# EAGLE design A111_Pulsed_Radar_Breakout (EAGLE 9.5.2)
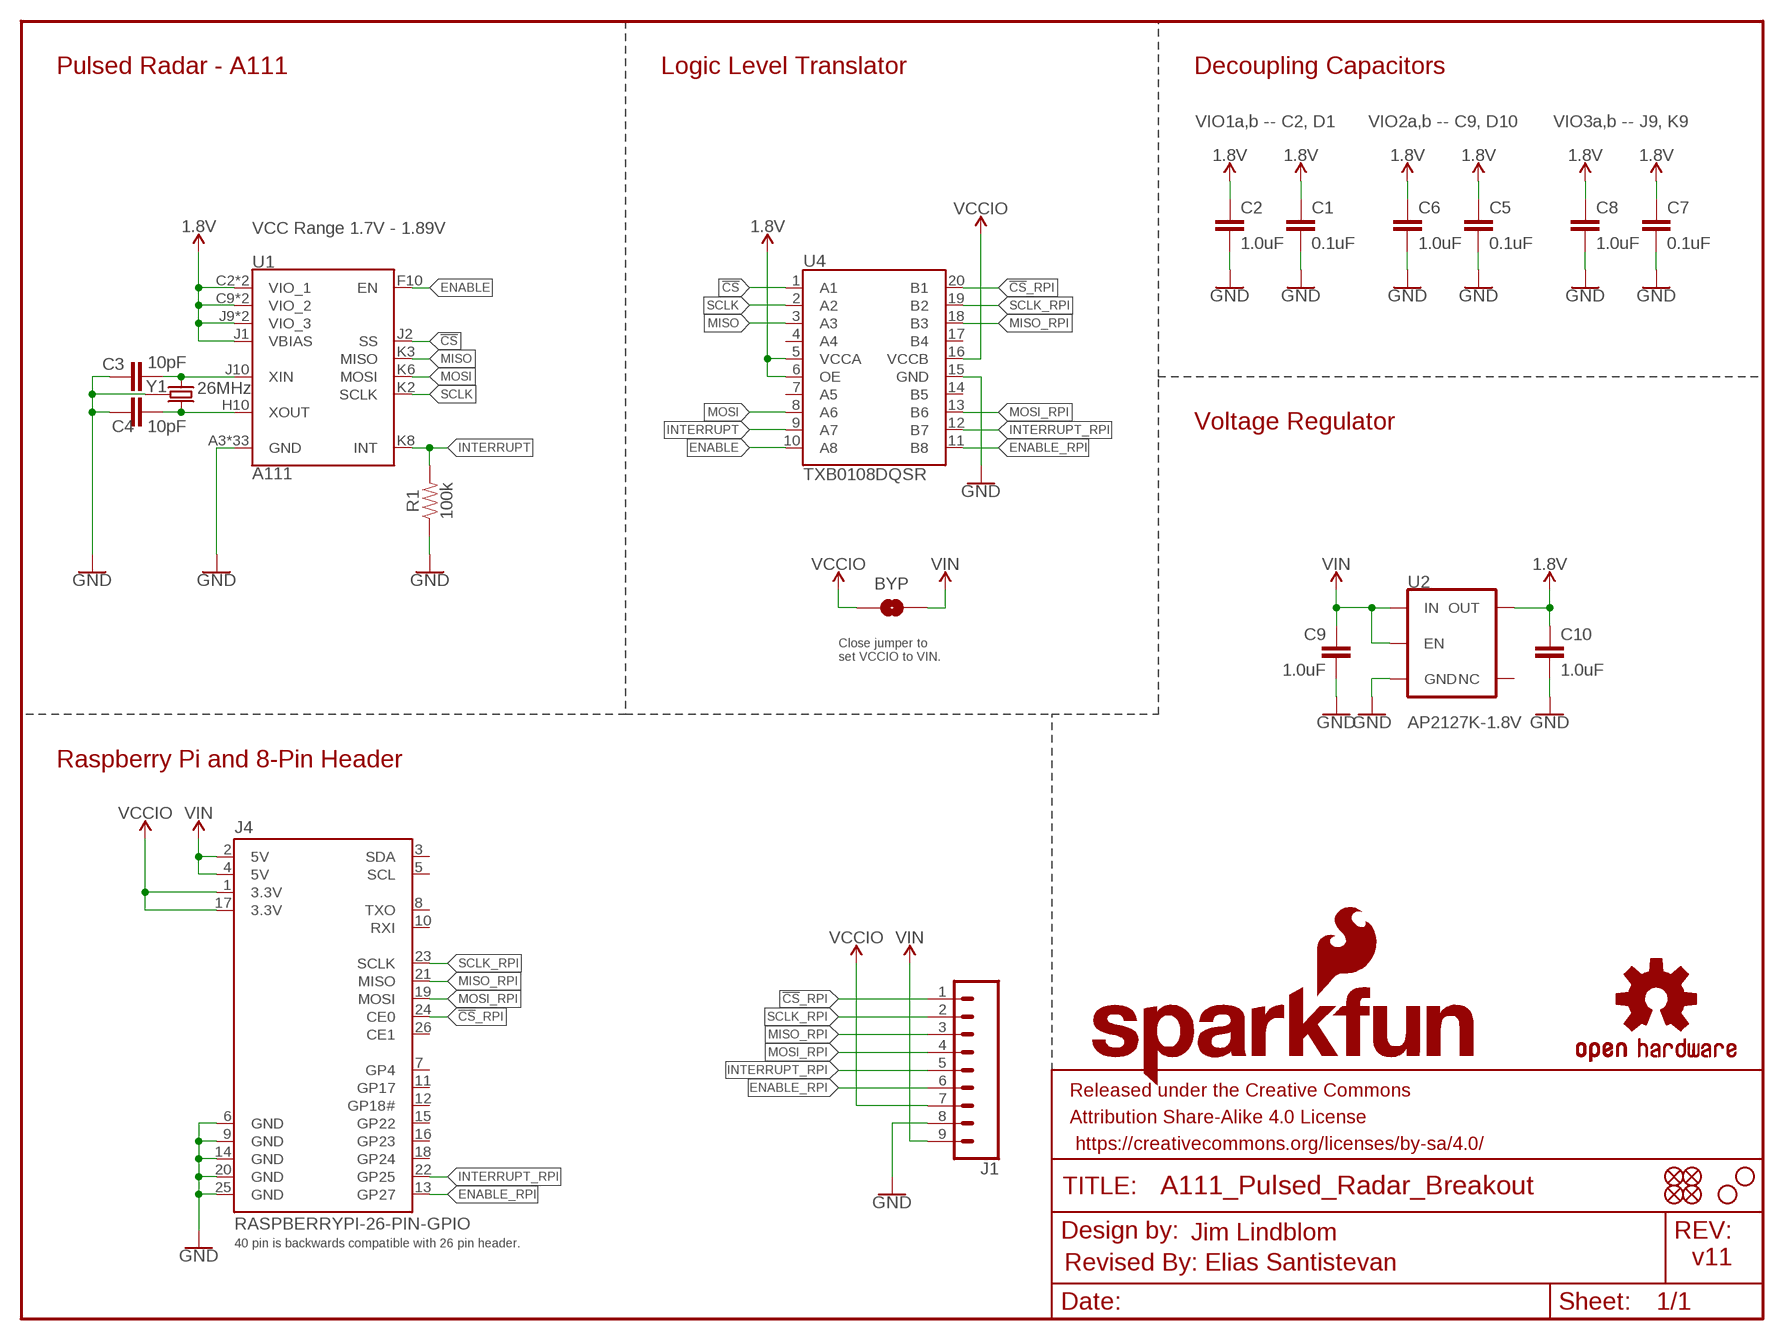
[diagram p0: schematic, sheet 1]

## Parts
BYP  JUMPER-SMT_2_NO_SILK  [SMT-JUMPER_2_NO_SILK]
C1  0.1uF  0.1UF-0603-25V-(+80/-20%)  [0603]
C2  1.0uF  1.0UF-0603-16V-10%  [0603]
C3  10pF  10PF-0603-50V-5%  [0603]
C4  10pF  10PF-0603-50V-5%  [0603]
C5  0.1uF  0.1UF-0603-25V-(+80/-20%)  [0603]
C6  1.0uF  1.0UF-0603-16V-10%  [0603]
C7  0.1uF  0.1UF-0603-25V-(+80/-20%)  [0603]
C8  1.0uF  1.0UF-0603-16V-10%  [0603]
C9  1.0uF  1.0UF-0603-16V-10%  [0603]
C10  1.0uF  1.0UF-0603-16V-10%  [0603]
FD1  FIDUCIALUFIDUCIAL  [FIDUCIAL-MICRO]
FD2  FIDUCIALUFIDUCIAL  [FIDUCIAL-MICRO]
FD3  FIDUCIALUFIDUCIAL  [FIDUCIAL-MICRO]
FD4  FIDUCIALUFIDUCIAL  [FIDUCIAL-MICRO]
FRAME1  FRAME-LETTER  [CREATIVE_COMMONS]
H1  STAND-OFF  [STAND-OFF]
H2  STAND-OFF  [STAND-OFF]
J1  CONN_09NO_SILK  [1X09_NO_SILK]
J4  RASPBERRYPI-26-PIN-GPIO  [2X13]
LOGO1  SFE_LOGO_NAME_FLAME.1_INCH  [SFE_LOGO_NAME_FLAME_.1]
LOGO2  OSHW-LOGOS  [OSHW-LOGO-S]
R1  100k  100KOHM-0603-1/10W-1%  [0603]
U1  A111  [A111]
U2  AP2127K-1.8V  V_REG_AP2127K-1.8V  [SOT23-5]
U4  TXB0108DQSR  TXB0108  [UFDFN-20]
Y1  26MHz  CRYSTAL-26MHZSMD-3.2X2.5  [CRYSTAL-SMD-3.2X2.5MM]

## Nets
1.8V: C1.1 C2.1 C5.1 C6.1 C7.1 C8.1 C10.1 U1.C2(VIO_1) U1.C9(VIO_2) U1.D1(VIO_1) U1.D10(VIO_2) U1.J1(VBIAS) U1.J9(VIO_3) U1.K9(VIO_3) U2.5(OUT) U4.5(VCCA) U4.6(OE)
!CS!: U1.J2(SS) U4.1(A1)
!CS!_RPI: J1.1 J4.24(CE0) U4.20(B1)
ENABLE: U1.F10(EN) U4.10(A8)
ENABLE_RPI: J1.6 J4.13(GP27) U4.11(B8)
GND: C1.2 C2.2 C3.2 C4.1 C5.2 C6.2 C7.2 C8.2 C9.2 C10.2 J1.8 J4.6(GND) J4.9(GND) J4.14(GND) J4.20(GND) J4.25(GND) R1.1 U1.A3(GND) U1.A4(GND) U1.A5(GND) U1.A6(GND) U1.A7(GND) U1.A8(GND) U1.A9(GND) U1.B2(GND) U1.B9(GND) U1.B10(GND) U1.C1(GND) U1.C10(GND) U1.D2(GND) U1.D9(GND) U1.E1(GND) U1.E2(GND) U1.E9(GND) U1.E10(GND) U1.F1(GND) U1.F2(GND) U1.F9(GND) U1.G1(GND) U1.G10(GND) U1.H1(GND) U1.H2(GND) U1.H9(GND) U1.J3(GND) U1.J5(GND) U1.J6(GND) U1.J8(GND) U1.K4(GND) U1.K5(GND) U1.K7(GND) U2.2(GND) U4.15(GND) Y1.2(GND) Y1.4(GND)
INTERRUPT: R1.2 U1.K8(INT) U4.9(A7)
INTERRUPT_RPI: J1.5 J4.22(GP25) U4.12(B7)
MISO: U1.K3(MISO) U4.3(A3)
MISO_RPI: J1.3 J4.21(MISO) U4.18(B3)
MOSI: U1.K6(MOSI) U4.8(A6)
MOSI_RPI: J1.4 J4.19(MOSI) U4.13(B6)
N$1: C3.1 U1.J10(XIN) Y1.1
N$2: C4.2 U1.H10(XOUT) Y1.3
SCLK: U1.K2(SCLK) U4.2(A2)
SCLK_RPI: J1.2 J4.23(SCLK) U4.19(B2)
VCCIO: BYP.1 J1.7 J4.1(3.3V) J4.17(3.3V) U4.16(VCCB)
VIN: BYP.2 C9.1 J1.9 J4.2(5V) J4.4(5V) U2.1(IN) U2.3(EN)
Unconnected: J4.3(SDA) J4.5(SCL) J4.7(GP4) J4.8(TXO) J4.10(RXI) J4.11(GP17) J4.12(GP18#) J4.15(GP22) J4.16(GP23) J4.18(GP24) J4.26(CE1) U2.4(NC) U4.4(A4) U4.7(A5) U4.14(B5) U4.17(B4)

## Notes on the sheet
- Pulsed Radar - A111 | Logic Level Translator | Decoupling Capacitors
- VIO1a,b -- C2, D1 | VIO2a,b -- C9, D10 | VIO3a,b -- J9, K9
- VCC Range 1.7V - 1.89V
- Voltage Regulator
- Close jumper to 
  set VCCIO to VIN.
- Raspberry Pi and 8-Pin Header
- Jim Lindblom
- 40 pin is backwards compatible with 26 pin header.
- Revised By: Elias Santistevan | v11

## Library data of the parts
BYP = SparkFun-Jumpers:JUMPER-SMT_2_NO: Normally open jumper This jumper has two pads in close proximity to each other. Apply solder to close the connection. Round pads are easier to solder for beginners, but are a lot larger. SparkFun Product that uses the round pads: SparkFun EL Sequencer <https://www.sparkfun.com/products/12781>
C1 C5 C7 = SparkFun-Capacitors:0.1UF: 0.1µF ceramic capacitors A capacitor is a passive two-terminal electrical component used to store electrical energy temporarily in an electric field.; PROD_ID: CAP-00810
C2 C6 C8-C10 = SparkFun-Capacitors:1.0UF: 1µF ceramic capacitors A capacitor is a passive two-terminal electrical component used to store electrical energy temporarily in an electric field.; PROD_ID: CAP-00868
C3 C4 = SparkFun-Capacitors:10PF: 10pF ceramic capacitors A capacitor is a passive two-terminal electrical component used to store electrical energy temporarily in an electric field.; PROD_ID: CAP-11812
FD1-FD4 = SparkFun-Aesthetics:FIDUCIAL: Fiducial Alignment Points Point-of-reference for pick-and-place machines and other optical instruments.
FRAME1 = SparkFun-Aesthetics:FRAME-LETTER: Schematic Frame - Letter Standard 8.5x11 US Letter frame
H1 H2 = SparkFun-Hardware:STAND-OFF: Stand Off Drill holes for mechanically mounting via screws, standoffs, etc. Note: Use the keepout ring to avoid running the screw head into surrounding components. Variant Overviews STAND-OFF - Mechanical footprint for a #4 phillips button head screw. STAND-OFF-TIGHT - Mechanical footprint for a #4 phillips button head screw, Example SparkFun Products Screw - Phillips Head (1/4", 4-40, 10 pack) <https://www.sparkfun.com/products/10453> (PRT-10453) Screw - Phillips Head (1/2", 4-40, 10 pack) <https://www.sparkfun.com/products/10452> (PRT-10452) Screw - Phillips Head (3/4", 4-40, 10 pack) <https://www.sparkfun.com/products/10451> (PRT-10451) Screw - Phillips Head (1", 4-40, 10 pack) <https://www.sparkfun.com/products/10450> (PRT-10450)
J1 = SparkFun-Connectors:CONN_09: Multi connection point. Often used as Generic Header-pin footprint for 0.1 inch spaced/style header connections On any of the 0.1 inch spaced packages, you can populate with these: Break Away Headers - Straight <https://www.sparkfun.com/products/116> (PRT-00116) Break Away Male Headers - Right Angle <https://www.sparkfun.com/products/553> (PRT-00553) Female Headers <https://www.sparkfun.com/products/115> (PRT-00115) Break Away Headers - Machine Pin <https://www.sparkfun.com/products/117> (PRT-00117) Break Away Female Headers - Swiss Machine Pin <https://www.sparkfun.com/products/743> (PRT-00743) For SCREWTERMINALS and SPRING TERMINALS visit here: Screw Terimnals on SparkFun.com <https://www.sparkfun.com/search/results?term=Screw+Terminals> (5mm/3.5mm/2.54mm spacing) This device is also useful as a general connection point to wire up your design to another part of your project. Our various solder wires solder well into these plated through hole pads. Hook-Up Wire - Assortment (Stranded, 22 AWG) <https://www.sparkfun.com/products/11375> (PRT-11375) Hook-Up Wire - Assortment (Solid Core, 22 AWG) <https://www.sparkfun.com/products/11367> (PRT-11367) View the entire wire category on our website here <https://www.sparkfun.com/categories/141> Special notes: Molex polarized connector foot print use with SKU : PRT-08231 with associated crimp pins and housings. 1MM SMD Version SKU: PRT-10208 NOTES ON THE VARIANTS LOCK and LOCK_LONGPADS... This footprint was designed to help hold the alignment of a through-hole component (i.e. 6-pin header) while soldering it into place. You may notice that each hole has been shifted either up or down by 0.005 of an inch from it's more standard position (which is a perfectly straight line). This slight alteration caused the pins (the squares in the middle) to touch the edges of the holes. Because they are alternating, it causes a "brace" to hold the component in place. 0.005 has proven to be the perfect amount of "off-center" position when using our standard breakaway headers. Although looks a little odd when you look at the bare footprint, once you have a header in there, the alteration is very hard to notice. Also,if you push a header all the way into place, it is covered up entirely on the bottom side.
J4 = SparkFun-Connectors:RASPBERRYPI-26-PIN-GPIO: RASPBERRY PI I/O HEADER As defined for the Revistion 2 Pi. The 40 pin header is backwards compatible with this smaller more compact footprint.
LOGO1 = SparkFun-Aesthetics:SFE_LOGO_NAME_FLAME: SparkFun Font Logo w/ Flame This is the SparkFun full logo. The logo on the schematic will always be the same size; the package variant is the height of the flame part of the logo. Default layer for the logo on the board is tSilk.
LOGO2 = SparkFun-Aesthetics:OSHW-LOGO: Open-Source Hardware (OSHW) Logo This logo indicates the piece of hardware it is found on incorporates a OSHW license and/or adheres to the definition of open source hardware found here: http://freedomdefined.org/OSHW
R1 = SparkFun-Resistors:100KOHM: 100kΩ resistor A resistor is a passive two-terminal electrical component that implements electrical resistance as a circuit element. Resistors act to reduce current flow, and, at the same time, act to lower voltage levels within circuits. - Wikipedia; PROD_ID: RES-07828
U1 = SparkFun-Sensors:A111; PROD_ID: IC-14498
U2 = SparkFun-IC-Power:V_REG_AP2127: AP2127 - 300mA CMOS LDO Regulator w/ Enable The AP2127 is CMOS process low dropout linear regulator with enable function, the regulator delivers a guaranteed 300mA (min.) continuous load current. Features Output Voltage Accuracy: ±1.5% Output Current: 300mA (Min.) Foldback Short Current Protection: 50mA Enable Function to Turn ON/OFF VOUT Low Dropout Voltage (3.3V): 250mV (Typ.) @IOUT=600mA Excellent Load Regulation: 0.2%/A (Typ.) Excellent Line Regulation: 0.02%/V (Typ.) Low Quiescent Current: 55μA (Typ.) Low Standby Current: 0.01μA (Typ.) Low Output Noise: 50μVRMS PSRR: 100Hz -65dB, 1kHz -65dB OTSD Protection Stable with 1.0μF Flexible Cap: Ceramic, Tantalum and Aluminum Electrolytic Operation Temperature Range: -40°C to 85°C ESD: MM 400V, HBM 4000V; PROD_ID: VREG-14239
U4 = SparkFun-IC-Comms:TXB0108: 8-Bit Bi-Directional Level Shifter Warning! Do not use for open-drain (I2C) signals. Consider TXS0108 1.2V-3.6V (VCCA) to 1.65V-5.5V (VCCB) bi-directional level shifter with auto direction sensing. Max data rate - VCCA 1.2V: 20Mbps (50ns), VCCA 3.3V: 100Mbps (10ns) Digikey: 296-27217-1-ND (20-UFDFN) SparkFun Products SparkFun GPS Logger Shield <https://www.sparkfun.com/products/13750> (GPS-13750) SparkFun Block for Intel® Edison - microSD <https://www.sparkfun.com/products/13041> (DEV-13041) SparkFun Block for Intel® Edison - Dual H-Bridge <https://www.sparkfun.com/products/13043> (DEV-13043) SparkFun Block for Intel® Edison - GPIO <https://www.sparkfun.com/products/13038> (DEV-13038) SparkFun Block for Intel® Edison - Raspberry Pi B <https://www.sparkfun.com/products/13044> (DEV-13044); PROD_ID: IC-12292
Y1 = SparkFun-Clocks:CRYSTAL-26MHZ: 26MHz Crystal w/ Ground Pin Digikey Example <http://www.digikey.com/product-detail/en/epson/TSX-3225%2026.0000MF09Z-AC3/SER3627CT-ND/1802878> Frequency: 26MHz Frequency Stability: ±9ppm Frequency Tolerance: ±10ppm Load Capacitance: 9pF SparkFun Products: SparkFun ESP32 Thing <https://www.sparkfun.com/products/13907> SparkFun ESP8266 Thing Dev Board <https://www.sparkfun.com/products/13711>; PROD_ID: XTAL-12454

## Board
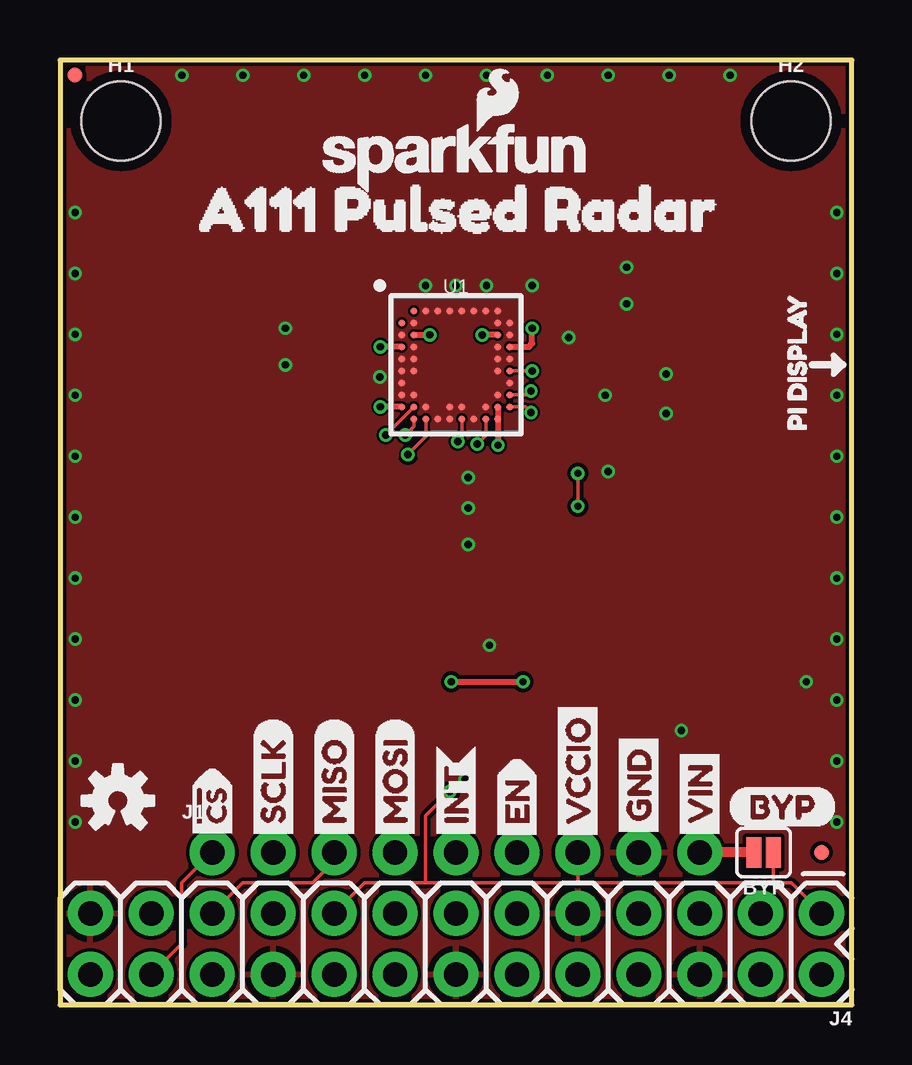
[diagram p1: board, top side]
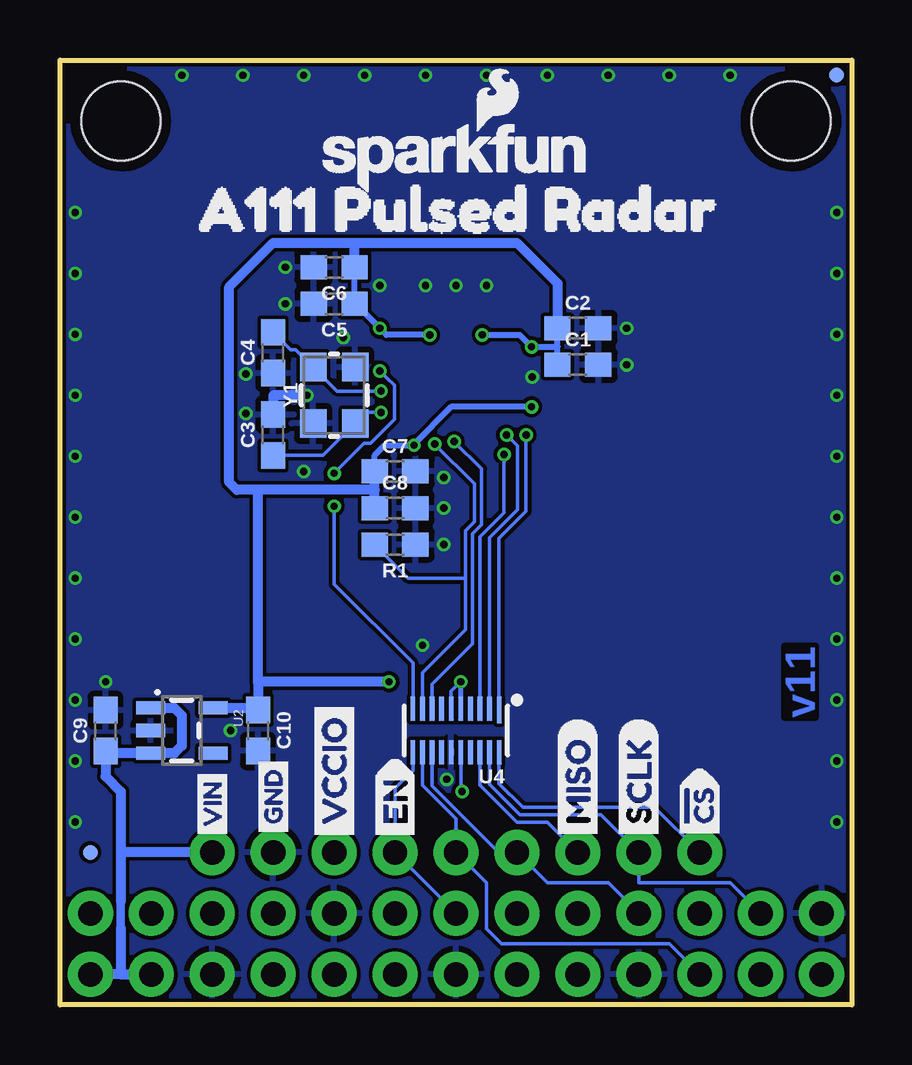
[diagram p2: board, bottom side, seen from below]

Size 33.02 x 39.37 mm. Coordinates in mm from the lower left corner, seen from the top.
Outline: 0,0 33.02,0 33.02,39.37 0,39.37 0,0
Copper layers (1*16): Top 0.035mm / dielectric 1.5mm / Bottom 0.035mm
Design rules "SparkFun-2-layer-FAB-LIMIT": minimum track width 4mil, minimum drill 6mil, track to track 4mil, track to pad 4mil, pad to pad 4mil, via to via 4mil, smd to smd 4mil, copper to edge 4mil, drill to drill 4mil, minimum pad ring 5mil, minimum via ring 5mil, stop-mask expansion 4mil, vias tented up to drill 25mil, thermal gap 10mil

### Footprints (pad centres in the part's own frame; a part is rotated, then mirrored left to right if it is on the bottom)
SMT-JUMPER_2_NO_SILK = smd 0.635 x 1.27: 1 -0.406,0; 2 0.406,0
0603 = smd 1.1 x 1: 1 -0.85,0; 2 0.85,0
FIDUCIAL-MICRO = smd 0.635 x 0.635: 1 0,0
STAND-OFF = hole 3.302: 0,0
1X09_NO_SILK = drill 1.016 pad 1.88: 1 0,0; 2 2.54,0; 3 5.08,0; 4 7.62,0; 5 10.16,0; 6 12.7,0; 7 15.24,0; 8 17.78,0; 9 20.32,0
2X13 = drill 1.016 pad 1.88: 1 0,0; 2 0,2.54; 3 2.54,0; 4 2.54,2.54; 5 5.08,0; 6 5.08,2.54; 7 7.62,0; 8 7.62,2.54; 9 10.16,0; 10 10.16,2.54; 11 12.7,0; 12 12.7,2.54; 13 15.24,0; 14 15.24,2.54; 15 17.78,0; 16 17.78,2.54; 17 20.32,0; 18 20.32,2.54; 19 22.86,0; 20 22.86,2.54; 21 25.4,0; 22 25.4,2.54; 23 27.94,0; 24 27.94,2.54; 25 30.48,0; 26 30.48,2.54
A111 = smd 0.3 x 0.3: A2 -1.75,2.25; A3 -1.25,2.25; A4 -0.75,2.25; A5 -0.25,2.25; A6 0.25,2.25; A7 0.75,2.25; A8 1.25,2.25; A9 1.75,2.25; B1 -2.25,1.75; B2 -1.75,1.75; B9 1.75,1.75; B10 2.25,1.75; C1 -2.25,1.25; C2 -1.75,1.25; C9 1.75,1.25; C10 2.25,1.25; D1 -2.25,0.75; D2 -1.75,0.75; D9 1.75,0.75; D10 2.25,0.75; E1 -2.25,0.25; E2 -1.75,0.25; E9 1.75,0.25; E10 2.25,0.25; F1 -2.25,-0.25; F2 -1.75,-0.25; F9 1.75,-0.25; F10 2.25,-0.25; G1 -2.25,-0.75; G10 2.25,-0.75; H1 -2.25,-1.25; H2 -1.75,-1.25; H9 1.75,-1.25; H10 2.25,-1.25; J1 -2.25,-1.75; J2 -1.75,-1.75; J3 -1.25,-1.75; J5 -0.25,-1.75; J6 0.25,-1.75; J8 1.25,-1.75; J9 1.75,-1.75; J10 2.25,-1.75; K2 -1.75,-2.25; K3 -1.25,-2.25; K4 -0.75,-2.25; K5 -0.25,-2.25; K6 0.25,-2.25; K7 0.75,-2.25; K8 1.25,-2.25; K9 1.75,-2.25
SOT23-5 = smd 0.55 x 1.2: 1 -0.95,-1.3; 2 0,-1.3; 3 0.95,-1.3; 4 0.95,1.3; 5 -0.95,1.3
UFDFN-20 = smd 0.2 x 1.1: 1 -1.8,-0.85 | smd 0.2 x 1: 2 -1.4,-0.9; 3 -1,-0.9; 4 -0.6,-0.9; 5 -0.2,-0.9; 6 0.2,-0.9; 7 0.6,-0.9; 8 1,-0.9; 9 1.4,-0.9; 10 1.8,-0.9; 11 1.8,0.9; 12 1.4,0.9; 13 1,0.9; 14 0.6,0.9; 15 0.2,0.9; 16 -0.2,0.9; 17 -0.6,0.9; 18 -1,0.9; 19 -1.4,0.9; 20 -1.8,0.9
CRYSTAL-SMD-3.2X2.5MM = smd 1.2 x 1.1: 1 -1.175,-0.875; 2 1.175,-0.875; 3 1.175,0.875; 4 -1.175,0.875

### Placement (x,y rotation side)
BYP  29.34,6.35 180 top
C1  11.43,26.67 0 bottom
C2  11.43,28.19 0 bottom
C3  24.13,23.75 90 bottom
C4  24.13,27.18 90 bottom
C5  21.59,29.21 180 bottom
C6  21.59,30.73 180 bottom
C7  19.05,22.23 0 bottom
C8  19.05,20.7 0 bottom
C9  31.11,11.43 90 bottom
C10  24.77,11.43 270 bottom
FD1  31.75,6.35 0 top
FD2  0.64,38.73 0 top
FD3  0.64,38.73 0 bottom
FD4  31.75,6.35 0 bottom
FRAME1  -5.84,-13.21 0 top  (outside the outline)
H1  2.54,36.83 0 top
H2  30.48,36.83 0 top
J1  6.35,6.35 0 top
J4  31.75,3.81 180 top
LOGO1  16.51,35.31 0 top
LOGO2  2.41,8.51 0 top
LOGO3  SFE_LOGO_NAME_FLAME.1_INCH  [SFE_LOGO_NAME_FLAME_.1]  16.51,35.31 0 bottom
R1  19.05,19.18 180 bottom
U1  16.51,26.67 0 top
U2  27.94,11.43 270 bottom
U4  16.51,11.43 180 bottom
U$1  [A111_PULSED_RADAR9]  4.19,33.15 0 top
U$2  [SCLK3]  8.89,6.6 90 top
U$3  [MISO4]  11.43,6.6 90 top
U$4  [MOSI5]  13.97,6.6 90 top
U$5  [INT8]  16.51,6.6 90 top
U$6  [EN9]  19.05,6.6 90 top
U$7  [GND0]  24.13,6.73 90 top
U$8  [BYP]  27.81,8.26 0 top
U$9  [A111_PULSED_RADAR9]  28.83,33.15 0 bottom
U$10  [SCLK3]  8.89,6.6 90 bottom
U$11  [MISO4]  11.43,6.6 90 bottom
U$12  [PI_DISPLAY9]  30.73,23.24 90 top
U$13  [#CS9]  6.35,6.48 90 bottom
U$16  [VIN0]  26.67,6.6 90 top
U$17  [#CS9]  6.35,6.48 90 top
U$18  [EN9]  19.05,6.6 90 bottom
U$19  [VCCIO1]  21.59,6.6 90 bottom
U$20  [VCCIO1]  21.59,6.6 90 top
U$21  [GND6]  24.13,6.73 90 bottom
U$22  [VIN5]  26.67,6.73 90 bottom
Y1  21.59,25.4 90 bottom

### Tracks (layer width: path | path; a pad name or v marks a point on that pad's centre or on a via)
1.8V  (via drill 0.3)
  Top 0.152: v17.6,27.92 v17.6,27.91
  Top 0.254: U1.C9 v17.6,27.92 | U1.C2 v15.42,27.92 | U1.D1 v13.36,27.42 | U1.J1 v13.36,24.92 | U1.J9 U1.K9 v18.26,23.32 | v16.31,13.46 v19.3,13.46 | v19.68,28.19 19.68,27.56 19.55,27.42 U1.D10
  Bottom 0.152: U4.6 16.71,13.06 v16.31,13.46
  Bottom 0.203: U4.5 v16.31,13.46
  Bottom 0.254: C1.1 12.28,27.43 | 12.28,27.43 C2.1 | 12.28,27.43 12.29,27.42 v13.36,27.42 13.86,27.92 v15.42,27.92 | C7.1 19.9,22.9 19.48,23.32 v18.26,23.32 18.26,23.37 16.71,24.92 v13.36,24.92 | C6.1 C5.1 20.7,29.21 v19.68,28.19 19.41,27.91 v17.6,27.91
  Bottom 0.406: C8.1 19.9,21.46 | 19.9,21.46 C7.1 | 20.74,31.75 24.13,31.75 25.96,29.92 25.96,21.77 25.65,21.46 24.77,21.46 | 20.74,31.75 13.97,31.75 12.28,30.06 C2.1 | C6.1 20.74,31.75 | U2.5 24.86,12.38 C10.1 24.77,13.46 | v19.3,13.46 24.77,13.46 | 24.77,13.46 24.77,21.46 | 19.9,21.46 24.77,21.46
!CS!  (via drill 0.3)
  Top 0.152: U1.J2 v13.59,23.75
  Bottom 0.152: U4.1 14.71,19.44 13.59,20.56 v13.59,23.75
!CS!_RPI
  Top 0.152: J4.24 5.08,2.54 5.08,5.08 J1.1
  Bottom 0.152: U4.20 14.71,9.22 13.72,8.23 8.23,8.23 J1.1
ENABLE  (via drill 0.3)
  Top 0.152: U1.F10 v19.69,26.42 v19.68,26.42 | v21.59,22.15 v21.59,20.78
  Bottom 0.152: v21.59,22.15 20.34,23.4 20.07,23.4 19.07,24.39 19.07,25.81 19.4,26.14 | v21.59,20.78 21.59,17.53 18.31,14.25 U4.10 | 19.4,26.14 | 19.4,26.14 v19.68,26.42
ENABLE_RPI
  Bottom 0.152: U4.11 18.31,9.76 19.05,9.02 J1.6 J4.13
GND  (via drill 0.3)
  Bottom 0.406: v22.73,25.4 24.13,25.4 C3.2
  other vias: 9.4,28.19 9.4,26.67 23.62,29.21 19.68,29.97 17.02,21.97 17.02,20.7 23.62,30.73 15.24,29.97 16.51,29.97 17.78,29.97 13.34,26.16 17.91,14.99 21.21,27.81 25.27,26.29 25.27,24.64 16.89,9.4 25.91,11.43 31.11,13.46 22.86,22.23 17.02,19.18 32.38,17.78 32.38,20.32 32.38,22.86 32.38,25.4 32.38,27.94 32.38,30.48 32.38,33.02 32.38,15.24 32.38,12.7 32.38,10.16 32.38,7.62 0.64,7.62 0.64,10.16 0.64,12.7 0.64,15.24 0.64,17.78 0.64,20.32 0.64,22.86 0.64,25.4 0.64,27.94 0.64,30.48 0.64,33.02 27.94,38.73 25.4,38.73 22.86,38.73 20.32,38.73 17.78,38.73 15.24,38.73 12.7,38.73 10.16,38.73 7.62,38.73 5.08,38.73
  pour Top (isolate 0.152): 0,39.37 0,0 33.02,0 33.02,39.37
  pour Bottom (isolate 0.152): 0,39.37 0,0 33.02,0 33.02,39.37
  pour Top (rank 2, no thermals): 12.7,30.48 12.7,22.86 20.32,22.86 20.32,30.48
INTERRUPT  (via drill 0.3)
  Top 0.152: U1.K8 17.76,23.73 v17.4,23.37
  Bottom 0.152: v17.4,23.37 15.75,21.72 15.75,20.13 16.12,19.76 16.12,17.78 | 16.12,17.78 16.12,15.63 17.91,13.84 U4.9 | R1.2 18.5,17.78 16.12,17.78
INTERRUPT_RPI
  Bottom 0.152: J4.22 7.62,2.54 14.61,2.54 15.24,3.17 15.24,5.08 J1.5 16.51,7.75 17.91,9.15 U4.12
MISO  (via drill 0.3)
  Top 0.152: U1.K3 15.26,23.69 v14.51,22.94
  Bottom 0.152: U4.3 15.51,19.5 14.51,20.51 v14.51,22.94
MISO_RPI
  Top 0.152: J4.21 7.62,5.08 10.54,5.08 11.43,5.97 J1.3
  Bottom 0.152: U4.18 15.51,9.16 13.97,7.62 12.7,7.62 J1.3
MOSI  (via drill 0.3)
  Top 0.152: U1.K6 16.76,23.65 v16.59,23.47
  Bottom 0.152: U4.8 17.51,13.35 15.81,15.05 15.81,19.63 15.44,20 15.44,22.33 v16.59,23.47
MOSI_RPI
  Bottom 0.152: J4.19 10.16,5.08 12.7,5.08 J1.4 14.73,6.35 17.51,9.13 U4.13
N$1  (via drill 0.3)
  Top 0.152: U1.J10 19.4,24.92 v19.63,24.69
  Bottom 0.152: v19.63,24.69 20.25,24.69 Y1.1 22.04,22.9 C3.1
N$2  (via drill 0.3)
  Top 0.152: U1.H10 19.48,25.42 v19.63,25.58
  Bottom 0.152: v19.63,25.58 21.47,25.58 Y1.3 23.2,27.3 23.41,27.3 C4.2
SCLK  (via drill 0.3)
  Top 0.152: U1.K2 14.76,24.11 v14.4,23.75
  Bottom 0.152: U4.2 15.11,19.47 13.95,20.64 13.95,23.3 v14.4,23.75
SCLK_RPI
  Bottom 0.152: J4.23 5.08,5.08 8.89,5.08 J1.2 10.46,7.92 13.84,7.92 15.11,9.19 U4.19
VCCIO  (via drill 0.3)
  Top 0.152: 15.24,5.08 12.7,5.08 J4.17 | v16.26,8.89 15.24,7.87 15.24,5.08 | J4.1 30.48,5.08 29.72,5.08 | 29.72,5.08 21.59,5.08 | J1.7 21.59,5.08 | 21.59,5.08 15.24,5.08 | BYP.1 29.74,5.11 29.72,5.08
  Bottom 0.152: v16.26,8.89 16.31,8.94 U4.16
VIN
  Top 0.406: BYP.2 J1.9
  Bottom 0.356: 30.48,4.32 30.48,3.17
  Bottom 0.406: 30.48,6.35 30.48,8.89 31.11,9.53 C9.1 31.02,10.48 U2.3 28.25,10.48 27.94,10.79 27.94,12.06 28.25,12.38 U2.1 | 30.48,6.35 30.48,4.32 | 30.48,3.17 30.48,1.27 | 30.48,1.27 J4.4 | 30.48,1.27 J4.2 | J1.9 30.48,6.35

### Text on the board
Bottom: v11
Measures: Units in Inches
tDocu: Jim Lindblom | Revised By: Elias Santistevan